# Altium schematic sheet nRF52840.SchDoc: =BoardTitle + ' - nRF52840 MCU'
size B; Organization: Nordic Semiconductor; DocumentNumber: 2; SheetNumber: 2; SheetTotal: 6; CompanyName: Nordic Semiconductor; DocumentSize: A3
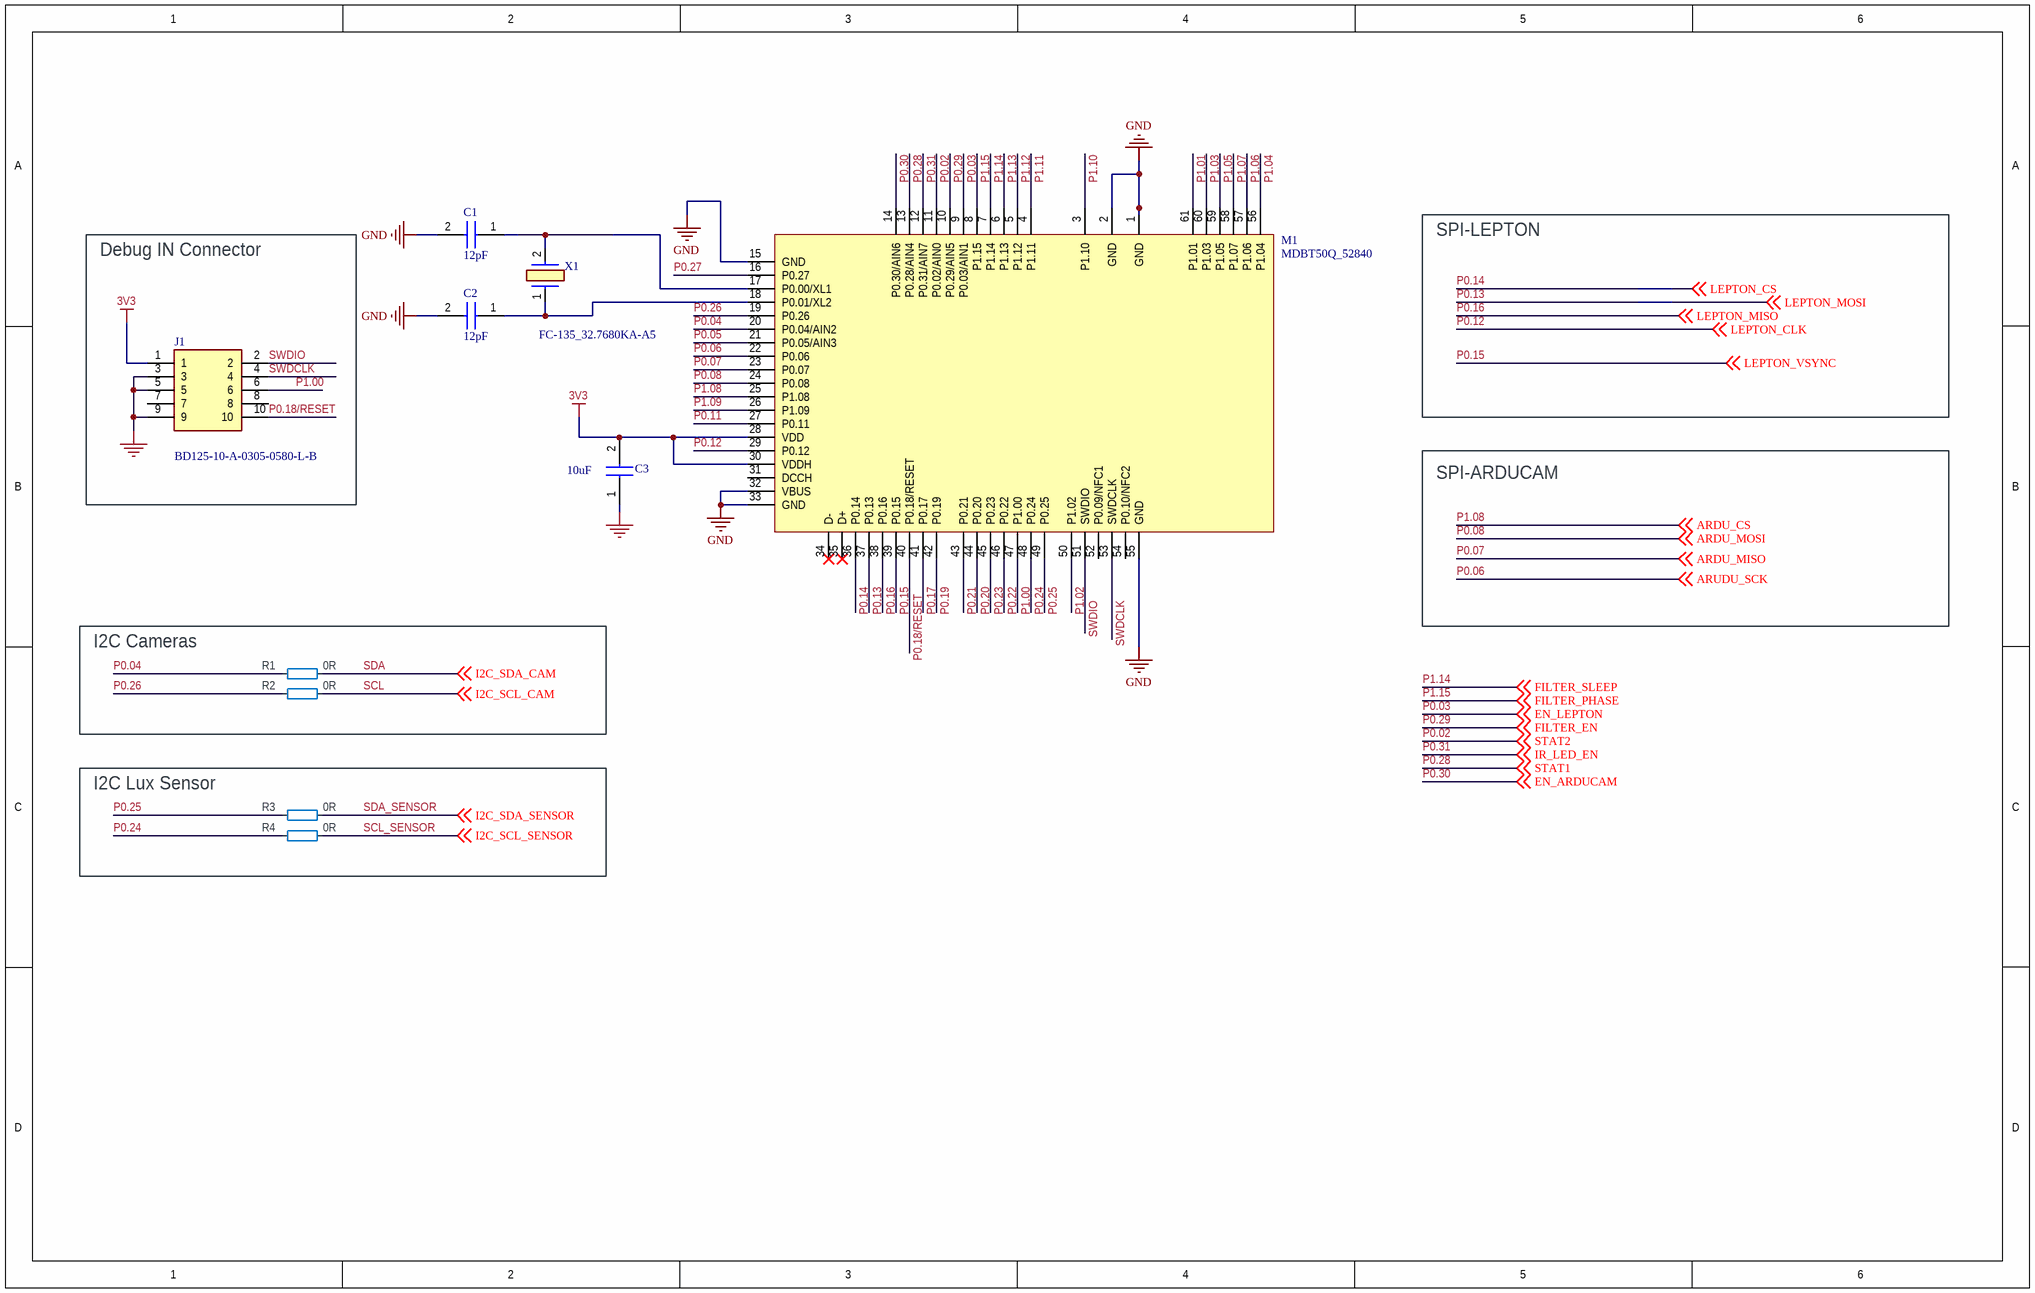
[diagram p0: nRF52840.SchDoc]

## Parts
C1  12pF  [CAPC1608X90N]
C2  12pF  [CAPC1608X90N]
C3  10uF  [CAPC1608X90N]
J1  BD125-10-A-0305-0580-L-B  [BD12510A03050580LB]
M1  MDBT50Q_52840  [MDBT50Q]
R1  0R  [RESC0603X03L_C]
R2  0R  [RESC0603X03L_C]
R3  0R  [RESC0603X03L_C]
R4  0R  [RESC0603X03L_C]
X1  FC-135_32.7680KA-A5  [FC135327680KAA5]

## Blocks framed on the sheet
Debug IN Connector: J1
I2C Cameras: R1 R2
I2C Lux Sensor: R3 R4

## Nets
3V3: C3.2 J1.1 M1.28(VDD) M1.30(VDDH)
GND: C1.2 C2.2 C3.1 J1.3 J1.5 J1.9 M1.1(GND) M1.2(GND) M1.15(GND) M1.32(VBUS) M1.33(GND) M1.55(GND)
P0.02: M1.11(P0.02/AIN0) ; off-sheet STAT2  [also labelled STAT2]
P0.03: M1.9(P0.03/AIN1) ; off-sheet EN_LEPTON  [also labelled EN_LEPTON]
P0.04: M1.20(P0.04/AIN2) R1.2
P0.05: M1.21(P0.05/AIN3)
P0.06: M1.22(P0.06) ; off-sheet ARUDU_SCK  [also labelled ARUDU_SCK]
P0.07: M1.23(P0.07) ; off-sheet ARDU_MISO  [also labelled ARDU_MISO]
P0.08: M1.24(P0.08) ; off-sheet ARDU_MOSI  [also labelled ARDU_MOSI]
P0.11: M1.27(P0.11)
P0.12: M1.29(P0.12) ; off-sheet LEPTON_CLK  [also labelled LEPTON_CLK]
P0.13: M1.37(P0.13) ; off-sheet LEPTON_MOSI  [also labelled LEPTON_MOSI]
P0.14: M1.36(P0.14) ; off-sheet LEPTON_CS  [also labelled LEPTON_CS]
P0.15: M1.39(P0.15) ; off-sheet LEPTON_VSYNC  [also labelled LEPTON_VSYNC]
P0.16: M1.38(P0.16) ; off-sheet LEPTON_MISO  [also labelled LEPTON_MISO]
P0.17: M1.41(P0.17)
P0.18/RESET: J1.10 M1.40(P0.18/RESET)
P0.19: M1.42(P0.19)
P0.20: M1.44(P0.20)
P0.21: M1.43(P0.21)
P0.22: M1.46(P0.22)
P0.23: M1.45(P0.23)
P0.24: M1.48(P0.24) R4.2
P0.25: M1.49(P0.25) R3.2
P0.26: M1.19(P0.26) R2.2
P0.27: M1.16(P0.27)
P0.28: M1.13(P0.28/AIN4) ; off-sheet STAT1  [also labelled STAT1]
P0.29: M1.10(P0.29/AIN5) ; off-sheet FILTER_EN  [also labelled FILTER_EN]
P0.30: M1.14(P0.30/AIN6) ; off-sheet EN_ARDUCAM  [also labelled EN_ARDUCAM]
P0.31: M1.12(P0.31/AIN7) ; off-sheet IR_LED_EN  [also labelled IR_LED_EN]
P1.00: J1.6 M1.47(P1.00)
P1.01: M1.61(P1.01)
P1.02: M1.50(P1.02)
P1.03: M1.60(P1.03)
P1.04: M1.56(P1.04)
P1.05: M1.59(P1.05)
P1.06: M1.57(P1.06)
P1.07: M1.58(P1.07)
P1.08: M1.25(P1.08) ; off-sheet ARDU_CS  [also labelled ARDU_CS]
P1.09: M1.26(P1.09)
P1.10: M1.3(P1.10)
P1.11: M1.4(P1.11)
P1.12: M1.5(P1.12)
P1.13: M1.6(P1.13)
P1.14: M1.7(P1.14) ; off-sheet FILTER_SLEEP  [also labelled FILTER_SLEEP]
P1.15: M1.8(P1.15) ; off-sheet FILTER_PHASE  [also labelled FILTER_PHASE]
SCL: R2.1 ; off-sheet I2C_SCL_CAM  [also labelled I2C_SCL_CAM]
SCL_SENSOR: R4.1 ; off-sheet I2C_SCL_SENSOR  [also labelled I2C_SCL_SENSOR]
SDA: R1.1 ; off-sheet I2C_SDA_CAM  [also labelled I2C_SDA_CAM]
SDA_SENSOR: R3.1 ; off-sheet I2C_SDA_SENSOR  [also labelled I2C_SDA_SENSOR]
SWDCLK: J1.4 M1.53(SWDCLK)
SWDIO: J1.2 M1.51(SWDIO)
NetC1_1: C1.1 M1.17(P0.00/XL1) X1.2
NetC2_1: C2.1 M1.18(P0.01/XL2) X1.1

Not connected (* = marked no-connect by the designer): J1 7 8; M1 31(DCCH) 34(D-)* 35(D+)* 52(P0.09/NFC1) 54(P0.10/NFC2)

## Notes on the sheet
- SPI-LEPTON
- SPI-ARDUCAM
- Title
- Size
- Date:
- File:
- A3
- PCB Assembly Number
- Sheet         of
- Drawn By:
- Revision
- Classification:

## Library data of the parts
C1-C3 = CC0603KRX7R0BB104: 0603 CAP X5R 25V; Manufacturer_Name: YAGEO; Datasheet Link: https://www.yageo.com/upload/media/product/products/datasheet/mlcc/UPY-NP0X7R_MV_100-to-630V_21.pdf; Height: 0.9mm; Manufacturer_Part_Number: CC0603KRX7R0BB104; Mouser Part Number: 603-CC603KRX7R0BB104; Mouser Price/Stock: https://www.mouser.co.uk/ProductDetail/YAGEO/CC0603KRX7R0BB104?qs=5eucE5Hus%252BjO6dm3Y8T6pg%3D%3D; Arrow Part Number: CC0603KRX7R0BB104; Arrow Price/Stock: https://www.arrow.com/en/products/cc0603krx7r0bb104/yageo?region=nac
J1 = BD125-10-A-0305-0580-L-B: Connector; Manufacturer_Name: GCT (GLOBAL CONNECTOR TECHNOLOGY); Datasheet Link: https://gct.co/connector/bd125; Height: 6.37mm; Manufacturer_Part_Number: BD125-10-A-0305-0580-L-B; Mouser Part Number: 640-BD12510A305580LB; Mouser Price/Stock: https://www.mouser.co.uk/ProductDetail/GCT/BD125-10-A-0305-0580-L-B?qs=amGC7iS6iy%252BPUE%252B5wV8wFA%3D%3D
M1 = MDBT50Q_52840: MDBT50Q(52840)
R1-R4 = RES: Resistor, ±5%, 1/10W 0603; Part Number: R0201-0R; Manufacturer: N.A.; Part number IPS: 00000003245; Part number NEMS: 100100001; Note: Chip Res 5%; Pad Count: 2; Component Status: Active; Manufacturer Part Number: N.A.; Footprint Doc: 0201; LatestRevisionDate: 2017-11-09; Published: 2014-11-13; Value: 0R; Artikkelnr Noca: N.A.; ComponentLink1URL: N.A.; ComponentLink1Description: Datasheet; ComponentLink2URL: N.A.; ComponentLink2Description: Supplier link; HelpURL: N.A.; Supplier 1: N.A.; Supplier Part Number 1: N.A.; Supplier 2: N.A.; Supplier Part Number 2: N.A.; Component Class: Resistors; PartId: 100100001; Author: rsk; Part number Norautron: N.A.
X1 = FC-135_32.7680KA-A5: Crystal or Oscillator; Manufacturer_Name: Epson Timing; Manufacturer_Part_Number: FC-135 32.7680KA-A5; Datasheet Link: https://support.epson.biz/td/api/doc_check.php?dl=brief_FC-135&lang=en; Height: 0.9mm; Mouser Part Number: 732-532.7680KA-A5; Mouser Price/Stock: https://www.mouser.co.uk/ProductDetail/Epson-Timing/FC-135-32.7680KA-A5?qs=f9yNj16SXrJ7J65t%252BHv0JQ%3D%3D; Arrow Part Number: FC-135 32.7680KA-A5; Arrow Price/Stock: https://www.arrow.com/en/products/fc-13532.7680ka-a5/epson-electronics-america?region=nac